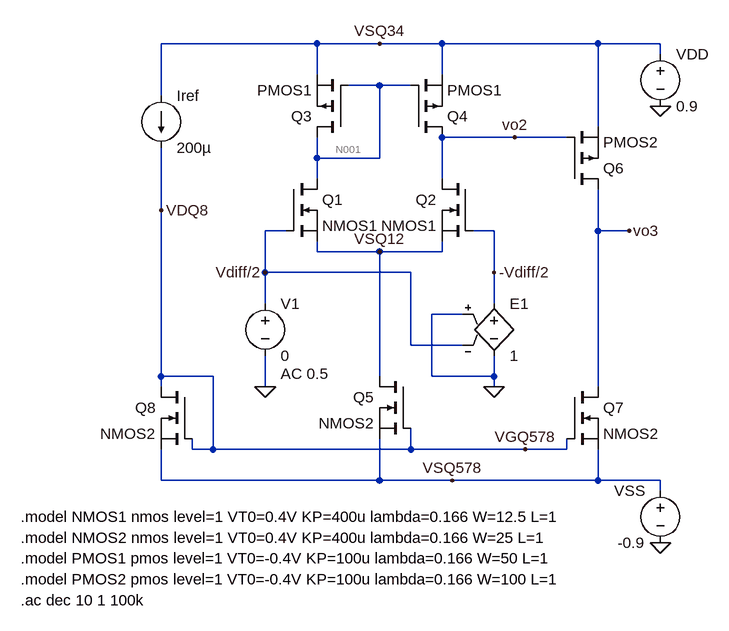
[diagram p0: schematic schema 2.17.d.asc]
schema 2.17.d.asc, the LTspice schematic file:
Version 4
SHEET 1 880 680
WIRE 128 -304 -112 -304
WIRE 224 -304 128 -304
WIRE 320 -304 224 -304
WIRE 560 -304 320 -304
WIRE 656 -304 560 -304
WIRE 656 -288 656 -304
WIRE 128 -256 128 -304
WIRE 320 -256 320 -304
WIRE 224 -240 176 -240
WIRE 272 -240 224 -240
WIRE -112 -224 -112 -304
WIRE 560 -176 560 -304
WIRE 432 -160 320 -160
WIRE 512 -160 432 -160
WIRE 128 -128 128 -160
WIRE 224 -128 224 -240
WIRE 224 -128 128 -128
WIRE 128 -96 128 -128
WIRE 320 -96 320 -160
WIRE -112 -48 -112 -144
WIRE 80 -16 48 -16
WIRE 400 -16 368 -16
WIRE 560 -16 560 -80
WIRE 608 -16 560 -16
WIRE 128 16 128 0
WIRE 224 16 128 16
WIRE 320 16 320 0
WIRE 320 16 224 16
WIRE 48 48 48 -16
WIRE 272 48 48 48
WIRE 400 48 400 -16
WIRE 48 96 48 48
WIRE 400 96 400 48
WIRE 352 112 304 112
WIRE 272 160 272 48
WIRE 352 160 272 160
WIRE -112 208 -112 -48
WIRE -32 208 -112 208
WIRE 224 208 224 16
WIRE 304 208 304 112
WIRE 400 208 400 176
WIRE 400 208 304 208
WIRE -112 224 -112 208
WIRE 48 224 48 176
WIRE 400 224 400 208
WIRE 560 224 560 -16
WIRE -64 320 -64 304
WIRE -32 320 -32 208
WIRE -32 320 -64 320
WIRE 272 320 272 288
WIRE 272 320 -32 320
WIRE 448 320 272 320
WIRE 512 320 512 304
WIRE 512 320 448 320
WIRE -112 368 -112 320
WIRE 224 368 224 304
WIRE 224 368 -112 368
WIRE 336 368 224 368
WIRE 560 368 560 320
WIRE 560 368 336 368
WIRE 656 368 560 368
WIRE 656 384 656 368
FLAG 656 -208 0
FLAG 656 464 0
FLAG -112 -48 VDQ8
FLAG 224 16 VSQ12
FLAG 336 368 VSQ578
FLAG 608 -16 vo3
FLAG 448 320 VGQ578
FLAG 432 -160 vo2
FLAG 224 -304 VSQ34
FLAG 48 224 0
FLAG 400 224 0
FLAG 48 48 Vdiff/2
FLAG 400 48 -Vdiff/2
SYMBOL nmos -64 224 M0
SYMATTR InstName Q8
SYMATTR Value NMOS2
SYMBOL nmos 272 208 M0
SYMATTR InstName Q5
SYMATTR Value NMOS2
SYMBOL nmos 512 224 R0
SYMATTR InstName Q7
SYMATTR Value NMOS2
SYMBOL voltage 656 -304 R0
SYMATTR InstName VDD
SYMATTR Value 0.9
SYMBOL voltage 656 368 M0
SYMATTR InstName VSS
SYMATTR Value -0.9
SYMBOL nmos 80 -96 R0
SYMATTR InstName Q1
SYMATTR Value NMOS1
SYMBOL nmos 368 -96 M0
SYMATTR InstName Q2
SYMATTR Value NMOS1
SYMBOL pmos 176 -160 R180
SYMATTR InstName Q3
SYMATTR Value PMOS1
SYMBOL pmos 272 -160 M180
SYMATTR InstName Q4
SYMATTR Value PMOS1
SYMBOL current -112 -224 R0
SYMATTR InstName Iref
SYMATTR Value 200µ
SYMBOL pmos 512 -80 M180
SYMATTR InstName Q6
SYMATTR Value PMOS2
SYMBOL voltage 48 80 R0
WINDOW 123 24 124 Left 2
WINDOW 39 0 0 Left 0
SYMATTR InstName V1
SYMATTR Value 0
SYMATTR Value2 AC 0.5
SYMBOL e 400 80 R0
SYMATTR InstName E1
SYMATTR Value 1
TEXT -328 424 Left 2 !.model NMOS1 nmos level=1 VT0=0.4V KP=400u lambda=0.166 W=12.5 L=1
TEXT -328 456 Left 2 !.model NMOS2 nmos level=1 VT0=0.4V KP=400u lambda=0.166 W=25 L=1
TEXT -328 488 Left 2 !.model PMOS1 pmos level=1 VT0=-0.4V KP=100u lambda=0.166 W=50 L=1
TEXT -328 520 Left 2 !.model PMOS2 pmos level=1 VT0=-0.4V KP=100u lambda=0.166 W=100 L=1
TEXT -328 552 Left 2 !.ac dec 10 1 100k

The netlist it stands for:
* schema 2.17.d.asc
M§Q8 VGQ578 VGQ578 VSQ578 VSQ578 NMOS2
M§Q5 VSQ12 VGQ578 VSQ578 VSQ578 NMOS2
M§Q7 vo3 VGQ578 VSQ578 VSQ578 NMOS2
VDD VSQ34 0 0.9
VSS VSQ578 0 -0.9
M§Q1 N001 Vdiff/2 VSQ12 VSQ12 NMOS1
M§Q2 vo2 -Vdiff/2 VSQ12 VSQ12 NMOS1
M§Q3 N001 N001 VSQ34 VSQ34 PMOS1
M§Q4 vo2 N001 VSQ34 VSQ34 PMOS1
Iref VSQ34 VGQ578 200µ
M§Q6 vo3 vo2 VSQ34 VSQ34 PMOS2
V1 Vdiff/2 0 0 AC 0.5
E1 -Vdiff/2 0 0 Vdiff/2 1
.model NMOS NMOS
.model PMOS PMOS
.lib standard.mos
.model NMOS1 nmos level=1 VT0=0.4V KP=400u lambda=0.166 W=12.5 L=1
.model NMOS2 nmos level=1 VT0=0.4V KP=400u lambda=0.166 W=25 L=1
.model PMOS1 pmos level=1 VT0=-0.4V KP=100u lambda=0.166 W=50 L=1
.model PMOS2 pmos level=1 VT0=-0.4V KP=100u lambda=0.166 W=100 L=1
.ac dec 10 1 100k
.backanno
.end

* Results of the author's LTspice run, read from the files saved beside the schematic
* Operating Point, zero values left out:
*   V(vgq578) = -309.1 mV
*   V(vsq578) = -900 mV
*   V(vsq12) = -582.7 mV
*   V(vo3) = -144.1 mV
*   V(vsq34) = 900 mV
*   V(n001) = 313.1 mV
*   V(vo2) = 313.1 mV
*   Id(Q6) = -205 µA
*   Ib(Q6) = 1.054 pA
*   Is(Q6) = 205 µA
*   Id(Q4) = -95.86 µA
*   Is(Q4) = 95.86 µA
*   Id(Q3) = -95.86 µA
*   Is(Q3) = 95.86 µA
*   Id(Q2) = 95.86 µA
*   Is(Q2) = -95.86 µA
*   Id(Q1) = 95.86 µA
*   Is(Q1) = -95.86 µA
*   Id(Q7) = 205 µA
*   Is(Q7) = -205 µA
*   Id(Q5) = 191.7 µA
*   Is(Q5) = -191.7 µA
*   Id(Q8) = 200 µA
*   Is(Q8) = -200 µA
*   I(Iref) = 200 µA
*   I(Vss) = 596.7 µA
*   I(Vdd) = -596.7 µA